# Altium schematic sheet [3]CAN_Communication.SchDoc
size A4; SheetNumber: 4; SheetTotal: 6
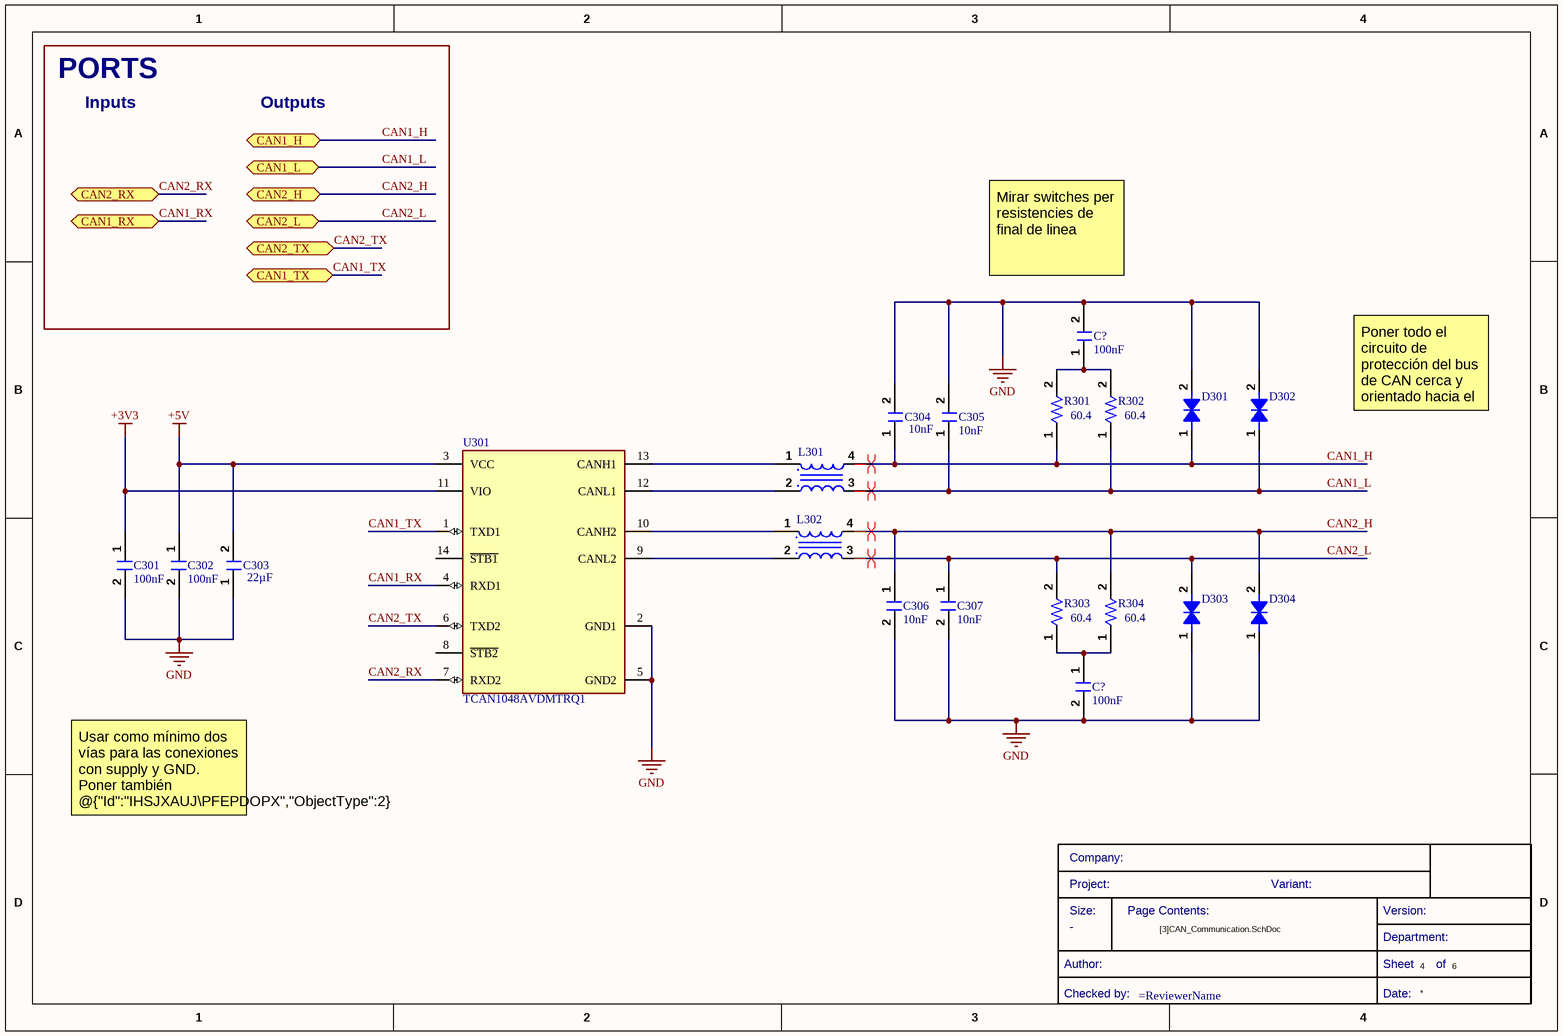
[diagram p0: [3]CAN_Communication.SchDoc]

## Parts
(Parts that share a designator on the sheet are numbered #1, #2 ... from top to bottom, then left to right.)
?  (no value)  (graphical)
C301  value 100nF  [C0805FNPC-R]  (hidden comment: C100n-50V-0805FNPC-X7R)
C302  value 100nF  [C0805FNPC-R]  (hidden comment: C100n-50V-0805FNPC-X7R)
C303  value 22µF  [C0805FNPC-W]  (hidden comment: C22u-10V-0805FNPC-X5R)
C304  value 10nF  [WCAP-CSGP_0805_L2W1.25H0.8_Reflow]  (hidden comment: C10n-100V-0805)
C305  value 10nF  [WCAP-CSGP_0805_L2W1.25H0.8_Reflow]  (hidden comment: C10n-100V-0805)
C306  value 10nF  [WCAP-CSGP_0805_L2W1.25H0.8_Reflow]  (hidden comment: C10n-100V-0805)
C307  value 10nF  [WCAP-CSGP_0805_L2W1.25H0.8_Reflow]  (hidden comment: C10n-100V-0805)
C?#1  value 100nF  [C0805FNPC-R]  (hidden comment: C100n-50V-0805FNPC-X7R)
C?#2  value 100nF  [C0805FNPC-R]  (hidden comment: C100n-50V-0805FNPC-X7R)
D301  DTVS-6V-DO-214AC  [DTVS-DO-214AC]  (value not drawn)
D302  DTVS-6V-DO-214AC  [DTVS-DO-214AC]  (value not drawn)
D303  DTVS-6V-DO-214AC  [DTVS-DO-214AC]  (value not drawn)
D304  DTVS-6V-DO-214AC  [DTVS-DO-214AC]  (value not drawn)
L301  CMC_10u_1.6A  [CMC_10u_1.6A]  (value not drawn)
L302  CMC_10u_1.6A  [CMC_10u_1.6A]  (value not drawn)
R301  value 60.4  [R0805FTK]  (hidden comment: R60-0805FTN)
R302  value 60.4  [R0805FTK]  (hidden comment: R60-0805FTN)
R303  value 60.4  [R0805FTK]  (hidden comment: R60-0805FTN)
R304  value 60.4  [R0805FTK]  (hidden comment: R60-0805FTN)
U301  TCAN1048AVDMTRQ1  [SOIC127P600X175-14N]

## Ports
CAN1_H (bidir, see Master_uC_PCB.SchDoc[1D]), CAN1_L (bidir, see Master_uC_PCB.SchDoc[1D]), CAN1_RX (bidir, see Master_uC_PCB.SchDoc[2D], [2]STM32L4[2B]), CAN1_TX (bidir, see Master_uC_PCB.SchDoc[2D], [2]STM32L4[2B]), CAN2_H (bidir, see Master_uC_PCB.SchDoc[1D]), CAN2_L (bidir, see Master_uC_PCB.SchDoc[1D]), CAN2_RX (bidir, see Master_uC_PCB.SchDoc[2D], [2]STM32L4[2C]), CAN2_TX (bidir, see Master_uC_PCB.SchDoc[2D], [2]STM32L4[2C])

## Nets
+3V3: C301.1 U301.11(VIO)
+5V: C302.1 C303.2 U301.3(VCC)
GND: C301.2 C302.2 C303.1 C304.2 C305.2 C306.2 C307.2 C?#1.2 C?#2.2 D301.2 D302.2 D303.1 D304.1 U301.2(GND1) U301.5(GND2)
CAN1_H: C304.1 D301.1 L301.4(4_OUT) R301.1 ; port CAN1_H
CAN1_L: C305.1 D302.1 L301.3(3_OUT) R302.1 ; port CAN1_L
CAN1_RX: U301.4(RXD1) ; port CAN1_RX
CAN1_TX: U301.1(TXD1) ; port CAN1_TX
CAN2_H: C306.1 D304.2 L302.4(4_OUT) R304.2 ; port CAN2_H
CAN2_L: C307.1 D303.2 L302.3(3_OUT) R303.2 ; port CAN2_L
CAN2_RX: U301.7(RXD2) ; port CAN2_RX
CAN2_TX: U301.6(TXD2) ; port CAN2_TX
NetC?#1_1: C?#1.1 R301.2 R302.2
NetC?#2_1: C?#2.1 R303.1 R304.1
NetL301_1: L301.1(1_IN) U301.13(CANH1)
NetL301_2: L301.2(2_IN) U301.12(CANL1)
NetL302_1: L302.1(1_IN) U301.10(CANH2)
NetL302_2: L302.2(2_IN) U301.9(CANL2)

Not connected (* = marked no-connect by the designer): U301 8(~{STB2}) 14(~{STB1})

## Layout directives
differential pair: (no net found under the mark)

## Notes on the sheet
- PORTS
- Inputs
- Outputs
- Mirar switches per resistencies de final de linea
- Poner todo el circuito de protección del bus de CAN cerca y orientado hacia el conector.
- Usar como mínimo dos vías para las conexiones con supply y GND. Poner también @{"Id":"IHSJXAUJ\PFEPDOPX","ObjectType":2} @{"Id":"IHSJXAUJ\DLGJLBMK","ObjectType":2} y @{"Id":"IHSJXAUJ\AUUMIETI","ObjectType":2} cerca de los pins de VCC y VIO.
- Size:
- Company:
- Project:
- Page Contents:
- Variant:
- Version:
- Checked by:
- Author:
- Sheet
- Date:
- Department:
- of

## Library data of the parts
? = CMP-00043-6: Standard Title Block
C301 C302 C?#1 C?#2 = CMP-00063-1: Cap, 0.1ΜF, 50V, 10%, X7R, 0805; Manufacturer 1: Wurth Electronics; Manufacturer Part Number 1: 885012207098; .Creator: DR; Pricing 1: 100=0,10200, 500=0,07100, 2000=0,06100 (GBP); ComponentLink1URL: http://www.farnell.com/datasheets/1958498.pdf?src-supplier=Farnell; Design Item ID: C100n-50V-0805FNPC-X7R; Voltage Rating (DC): 50V; Voltage Rating: 50V; Max Operating Temperature: 125°C; RoHS: Yes; Case Code (Metric): 2012; Mount: Surface Mount; REACH SVHC: Unknown; Stock 1: 8000; Source: Passives.SchLib; Tolerance: 10%; RoHS Compliant: Yes; Dielectric: X7R; ComponentLink2Description: http://www.farnell.com/datasheets/1958498.pdf?src-supplier=Element14; ComponentLink2URL: http://www.farnell.com/datasheets/1958498.pdf?src-supplier=Element14; Min Operating Temperature: -55°C; Width: 0.049inch; Category: Ceramic Capacitors; Thickness: 0.035inch; Length: 0.079inch; ComponentLink3URL: https://katalog.we-online.de/pbs/datasheet/885012207098.pdf?src-supplier=Digi-Key; Case/Package: 0805; ComponentLink3Description: https://katalog.we-online.de/pbs/datasheet/885012207098.pdf?src-supplier=Digi-Key; Packaging: Cut Tape; ComponentLink1Description: http://www.farnell.com/datasheets/1958498.pdf?src-supplier=Farnell; ComponentLink4Description: http://www.farnell.com/datasheets/1958498.pdf?src-supplier=Newark; ComponentLink4URL: http://www.farnell.com/datasheets/1958498.pdf?src-supplier=Newark
C303 = CMP-00058-1: Multilayer Ceramic Capacitor, Wcap-Csgp Series, 22 F, 20%, X5R, 10 V, 0805 [2012 Metric] Rohs Compliant: Yes; Manufacturer: Wurth Electronics; Manufacturer Part Number: 885012107011; Voltage Rating (DC): 10V; .Creator: DR; Length: 0.079inch; ComponentLink3URL: http://www.farnell.com/datasheets/1958453.pdf?src-supplier=Element14; ComponentLink1Description: http://www.farnell.com/datasheets/1958453.pdf?src-supplier=Farnell; ComponentLink2Description: http://www.farnell.com/datasheets/1958453.pdf?src-supplier=Newark; Dielectric: X5R; ComponentLink5Description: Where buy it; Thickness: 0.057inch; Min Operating Temperature: -55°C; RoHS Compliant: Yes; ComponentLink2URL: http://www.farnell.com/datasheets/1958453.pdf?src-supplier=Newark; Case Code (Metric): 2012; Tolerance: 20%; ComponentLink5URL: https://www.we-online.com/catalog/en/WCAP-CSGP-10VDC#885012107011; Source: Passives.SchLib; ComponentLink1URL: http://www.farnell.com/datasheets/1958453.pdf?src-supplier=Farnell; Category: Ceramic Capacitors; ComponentLink4URL: https://katalog.we-online.de/pbs/datasheet/885012107011.pdf?src-supplier=Digi-Key; RoHS: Yes; ComponentLink4Description: https://katalog.we-online.de/pbs/datasheet/885012107011.pdf?src-supplier=Digi-Key; Design Item ID: C22u-10V-0805FNPC-X5R; ComponentLink3Description: http://www.farnell.com/datasheets/1958453.pdf?src-supplier=Element14; Mount: Surface Mount; REACH SVHC: Unknown; Width: 0.049inch; Max Operating Temperature: 85°C; Case/Package: 0805; Stock 1: 8800; Pricing 1: 20=0,15300, 100=0,40300, 200=0,37700, 500=0,35100, 1000=0,31700 (GBP); Voltage Rating: 10V; Packaging: Cut Tape
C304-C307 = CMP-001-00007-2: Cap Cer 10000PF 100V X7R 0805
D301-D304 = CMP-00154-1: TVS diode [Würth Elektronik] 824501600 TVS diode; Manufacturer: Wurth Electronics; Power Line Protection: No; Forward Voltage: 7.02V; Number of Bidirectional Channels: 1; Peak Pulse Current: 38.8A; Reverse Standoff Voltage: 6V; .Creator: DO; Polarity: Bidirectional; Peak Pulse Power: 400W; Clamping Voltage: 10.3V; ComponentLink2Description: http://www.farnell.com/datasheets/2036401.pdf?src-supplier=Element14; Source: Filter components.SchLib; ComponentLink3URL: https://katalog.we-online.de/pbs/datasheet/824501600.pdf?src-supplier=Digi-Key; Mount: Surface Mount; Design Item ID: DTVS-6V-DO-214AC; ComponentLink3Description: https://katalog.we-online.de/pbs/datasheet/824501600.pdf?src-supplier=Digi-Key; RoHS: Yes; Resistor Type: Zener; REACH SVHC: Unknown; Pins: 2; Min Breakdown Voltage: 7.02V; Min Operating Temperature: -65°C; ComponentLink1URL: https://www.we-online.com/catalog/en/WE-TVSP?sq=824501600#824501600; Stock 1: 780; Pricing 1: 1=0,28000, 10=0,26100, 50=0,26100, 100=0,23400, 500=0,20400, 1000=0,17400, 10000=0,17400 (USD); ComponentLink2URL: http://www.farnell.com/datasheets/2036401.pdf?src-supplier=Element14; Category: TVS Diodes; ComponentLink1Description: Where buy it; Manufacturer Part Number: 824501600; Packaging: Cut Tape; RoHS Compliant: Yes; Max Operating Temperature: 150°C
L301 L302 = CMP-00160-1: Common Mode Chokes Dual 10uH 920Ohm 1kHz 1.6A 80mOhm DCR SMD T/R; Manufacturer: Wurth Electronics; Manufacturer Part Number: 744226; Voltage Rating: 80V; Inductance Tolerance: 30%; Number of Lines: 2; Impedance: 920R; Core Material: Ferrite; DC Resistance (DCR): 80mR; .Creator: GP; Resistance: 80m; Inductance: 10uH; DC Current: 1.6A; Source: Filter components.SchLib; Length: 9.2mm; Current Rating: 1.6A; ComponentLink2Description: Where buy it; Design Item ID: CMC_10u_1.6A; Tolerance: 30%; Height: 5mm; RoHS Compliant: Yes; RoHS: Yes; Case/Package: SMD/SMT; Package Quantity: 1; Category: Common Mode Line Filter; Current: 1.6A; Depth: 6.3mm; REACH SVHC: No SVHC; ComponentLink1URL: https://www.we-online.com/catalog/datasheet/744226.pdf; Termination: SMD/SMT; Min Operating Temperature: -40°C; ComponentLink1Description: Datasheet; Width: 6mm; Stock 1: 1943; Lead Free: Lead Free; Series: WE-SL2; ComponentLink2URL: https://www.we-online.com/catalog/en/WE-SL2?sq=744226#744226; Number of Pins: 4; Mount: Surface Mount; Test Frequency: 1kHz; Packaging: Tape and Reel; Pricing 1: 1=2,55000, 10=2,51500, 50=2,27200, 100=2,19100, 500=2,02900 (USD); Voltage Rating (DC): 80V; Weight: 0.017672oz; Max DC Current: 1.6A; Max Operating Temperature: 125°C
R301-R304 = CMP-00080-1: Res Thin Film 0805 60.4 Ohm 0.1% 1/8W ±25ppm/°C Molded SMD SMD Punched Carrier T/R; Manufacturer 1: Panasonic; Manufacturer Part Number 1: ERA-6AEB60R4V; Voltage Rating (DC): 100V; Power Rating: 125mW; Voltage Rating: 200V; .Creator: DR; Lead Free: Lead Free; ComponentLink4URL: https://datasheet.ciiva.com/30184/54aoa0000ce26-30184022.pdf?src-supplier=Onlinecomponents.com; Source: Passives.SchLib; Radiation Hardening: No; ComponentLink5Description: https://datasheet.ciiva.com/9188/aoa0000ce26-9188476.pdf?src-supplier=Avnet; Depth: 1.25mm; Length: 2mm; ComponentLink3Description: https://datasheet.ciiva.com/5951/485442-5951173.pdf?src-supplier=Farnell; RoHS: Yes; Tolerance: 0.1%; Termination: SMD/SMT; ComponentLink1Description: https://datasheet.ciiva.com/11811/0900766b80eb1d8c-11811180.pdf?src-supplier=RSComponents; Max Power Dissipation: 125mW; Package Quantity: 5000; Mount: Surface Mount; Number of Terminations: 2; Temperature Coefficient: 25ppm/°C; Case/Package: 0805; Packaging: Tape and Reel; Contact Plating: Tin; Category: Chip SMD Resistors; ComponentLink1URL: https://datasheet.ciiva.com/11811/0900766b80eb1d8c-11811180.pdf?src-supplier=RSComponents; Features: Automotive AEC-Q200; Weight: 0.000194oz; Resistor Type: Thin Film,Metal Film; Design Item ID: R60-0805FTN; Stock 1: 5000; Case Code (Metric): 2012; ComponentLink2Description: https://datasheet.ciiva.com/41450/001181146-da-01-en-widerstand-era-0805-60r4-0-1-5000st-41450303.pdf?src-supplier=Conrad; ComponentLink4Description: https://datasheet.ciiva.com/30184/54aoa0000ce26-30184022.pdf?src-supplier=Onlinecomponents.com; ComponentLink3URL: https://datasheet.ciiva.com/5951/485442-5951173.pdf?src-supplier=Farnell; Max Operating Temperature: 155°C; Pricing 1: 1=0,04650, 10=0,03900, 100=0,02860 (USD); ComponentLink2URL: https://datasheet.ciiva.com/41450/001181146-da-01-en-widerstand-era-0805-60r4-0-1-5000st-41450303.pdf?src-supplier=Conrad; ComponentLink5URL: https://datasheet.ciiva.com/9188/aoa0000ce26-9188476.pdf?src-supplier=Avnet; Min Operating Temperature: -55°C; Pins: 2; Width: 1.25mm; Height: 0.5mm
U301 = CMP-015-00008-1: Enhanced Automotive dual CAN transceiver with inverted Standby and 1.8-V I/O Support 14-VSON -40 to 150